# EAGLE design esp3212 breakout v1 (EAGLE 7.6.0)
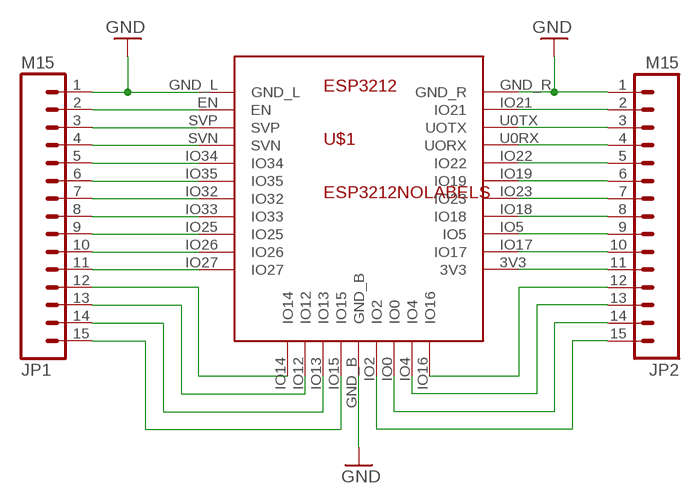
[diagram p0: schematic, sheet 1]

## Parts
JP1  M15  [1X15]
JP2  M15  [1X15]
U$1  ESP3212NOLABELS  [ESP3212_NOPINLABELS]

## Nets
GND: JP1.1 JP2.1 U$1.GND_B U$1.GND_L U$1.GND_R
N$2: JP1.2 U$1.EN
N$3: JP1.3 U$1.SVP
N$4: JP1.4 U$1.SVN
N$5: JP1.5 U$1.IO34
N$6: JP1.6 U$1.IO35
N$7: JP1.7 U$1.IO32
N$8: JP1.8 U$1.IO33
N$9: JP1.9 U$1.IO25
N$10: JP1.10 U$1.IO26
N$11: JP1.11 U$1.IO27
N$13: JP2.2 U$1.IO21
N$14: JP2.3 U$1.U0TX(UOTX)
N$15: JP2.4 U$1.U0RX(UORX)
N$16: JP2.5 U$1.IO22
N$17: JP2.6 U$1.IO19
N$18: JP2.7 U$1.IO23
N$19: JP2.8 U$1.IO18
N$20: JP2.9 U$1.IO5
N$21: JP2.10 U$1.IO17
N$22: JP2.11 U$1.3V3
N$23: JP1.12 U$1.IO14
N$24: JP1.13 U$1.IO12
N$25: JP1.14 U$1.IO13
N$26: JP1.15 U$1.IO15
N$27: JP2.12 U$1.IO16
N$28: JP2.13 U$1.IO4
N$29: JP2.14 U$1.IO0
N$30: JP2.15 U$1.IO2

## Library data of the parts
JP1 JP2 = SparkFun-Connectors:M15: Header 15 Standard 15-pin 0.1" header. Use with straight break away headers (SKU : PRT-00116), right angle break away headers (PRT-00553), swiss pins (PRT-00743), machine pins (PRT-00117), and female headers (PRT-00115).
U$1 = esp3212-ptw:ESP3212

## Net classes
0 default: width 0.152 mm, clearance 0.254 mm

## Board
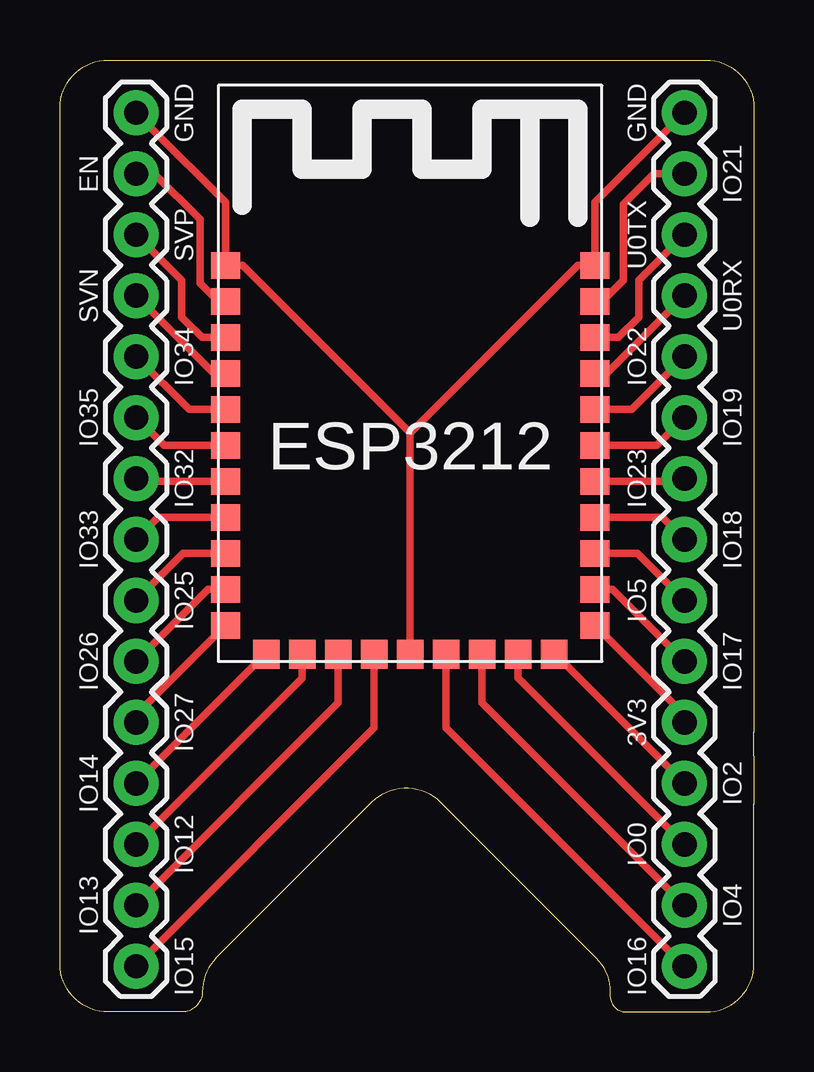
[diagram p1: board, top side]

Size 28.94 x 39.66 mm. Coordinates in mm from the lower left corner, seen from the top.
Outline: 0,2 0,37.66 arc-90 2,39.66 26.94,39.66 arc-90 28.94,37.66 28.94,11.66 28.94,10.66 28.94,8.66 28.94,2 arc-90 26.94,0 23.6,0 arc-90 22.94,0.66 22.94,0.84 arc45 22.35,2.25 15.85,8.75 arc90 13.02,8.75 6.52,2.25 arc45 5.94,0.84 arc-90 5.1,0 2,0 arc-90 0,2
Copper layers (1*16): Top 0.035mm / dielectric 1.5mm / Bottom 0.035mm
Design rules "MF_Standard_2_Layer": minimum track width 5mil, minimum drill 12mil, track to track 5mil, track to pad 5mil, pad to pad 5mil, via to via 5mil, smd to smd 0mil, copper to edge 10mil, drill to drill 10mil, minimum pad ring 6mil, minimum via ring 6mil, stop-mask expansion 2mil, vias tented up to drill 25mil, thermal gap 10mil

### Footprints (pad centres in the part's own frame; a part is rotated, then mirrored left to right if it is on the bottom)
1X15 = drill 1.016 pad 1.88: 1 0,0; 2 2.54,0; 3 5.08,0; 4 7.62,0; 5 10.16,0; 6 12.7,0; 7 15.24,0; 8 17.78,0; 9 20.32,0; 10 22.86,0; 11 25.4,0; 12 27.94,0; 13 30.48,0; 14 33.02,0; 15 35.56,0
ESP3212_NOPINLABELS = smd 1.2 x 1.1: 3V3 15.7,1.5; EN 0.3,15; GND_L 0.3,16.5; GND_R 15.7,16.5; IO5 15.7,4.5; IO17 15.7,3; IO18 15.7,6; IO19 15.7,9; IO21 15.7,15; IO22 15.7,10.5; IO23 15.7,7.5; IO25 0.3,4.5; IO26 0.3,3; IO27 0.3,1.5; IO32 0.3,7.5; IO33 0.3,6; IO34 0.3,10.5; IO35 0.3,9; SVN 0.3,12; SVP 0.3,13.5; U0RX 15.7,12; U0TX 15.7,13.5 | smd 1.1 x 1.2: GND_B 8,0.3; IO0 11,0.3; IO2 9.5,0.3; IO4 12.5,0.3; IO12 3.5,0.3; IO13 5,0.3; IO14 2,0.3; IO15 6.5,0.3; IO16 14,0.3

### Placement (x,y rotation side)
JP1  3.18,37.46 270 top
JP2  26.04,37.46 270 top
U$1  6.6,14.61 0 top

### Tracks (layer width: path | path; a pad name or v marks a point on that pad's centre or on a via)
GND
  Top 0.305: JP1.1 3.81,36.83 6.9,33.74 U$1.GND_L 7.62,31.12 14.6,24.13 | JP2.1 22.3,33.73 U$1.GND_R 21.59,31.12 14.61,24.13 14.6,24.13 | U$1.GND_B 14.6,23.41 14.6,24.13
N$2
  Top 0.305: 6.84,29.6 U$1.EN 6.59,29.6 5.84,30.35 5.84,30.61 5.84,33.02 3.94,34.92 JP1.2
N$3
  Top 0.305: U$1.SVP 5.93,28.1 5.21,28.83 5.08,28.96 5.08,30.48 JP1.3
N$4
  Top 0.305: JP1.4 6.42,26.6 U$1.SVN
N$5
  Top 0.305: JP1.5 5.38,25.1 U$1.IO34
N$6
  Top 0.305: JP1.6 4.33,23.6 U$1.IO35
N$7
  Top 0.305: JP1.7 3.29,22.1 U$1.IO32
N$8
  Top 0.305: JP1.8 4.1,20.6 U$1.IO33
N$9
  Top 0.305: U$1.IO25 5.13,19.1 JP1.9
N$10
  Top 0.305: U$1.IO26 6.17,17.61 JP1.10
N$11
  Top 0.305: JP1.11 3.18,12.38 U$1.IO27
N$13
  Top 0.305: U$1.IO21 22.62,29.6 23.5,30.48 23.5,33.66 24.77,34.92 JP2.2
N$14
  Top 0.305: JP2.3 24.13,30.48 24.13,28.96 23.28,28.1 U$1.U0TX
N$15
  Top 0.305: JP2.4 22.86,26.67 22.8,26.6 U$1.U0RX
N$16
  Top 0.305: JP2.5 23.84,25.1 U$1.IO22
N$17
  Top 0.305: JP2.6 24.88,23.6 U$1.IO19
N$18
  Top 0.305: JP2.7 25.91,22.1 U$1.IO23
N$19
  Top 0.305: JP2.8 25.12,20.6 U$1.IO18
N$20
  Top 0.305: U$1.IO5 24.08,19.1 JP2.9
N$21
  Top 0.305: U$1.IO17 23.04,17.61 JP2.10
N$22
  Top 0.305: JP2.11 26.04,12.37 U$1.3V3
N$23
  Top 0.305: JP1.12 8.56,14.9 U$1.IO14
N$24
  Top 0.305: JP1.13 10.1,13.91 U$1.IO12
N$25
  Top 0.305: JP1.14 11.6,12.87 U$1.IO13
N$26
  Top 0.305: JP1.15 13.1,11.83 U$1.IO15
N$27
  Top 0.305: U$1.IO16 20.66,14.9 JP2.12
N$28
  Top 0.305: U$1.IO4 19.1,13.92 JP2.13
N$29
  Top 0.305: U$1.IO0 17.6,12.88 JP2.14
N$30
  Top 0.305: U$1.IO2 16.1,11.84 JP2.15

### Text on the board
tNames: GND | GND | EN | IO21 | SVP | U0TX | SVN | U0RX | IO34 | IO22 | IO35 | IO19 | IO32 | IO23 | IO33 | IO18 | IO25 | IO5 | IO26 | IO17 | IO27 | 3V3 | IO14 | IO2 | IO12 | IO0 | IO13 | IO4 | IO15 | IO16